# EAGLE schematic Main (EAGLE 7.4.0)

## Sheet 1 of 4
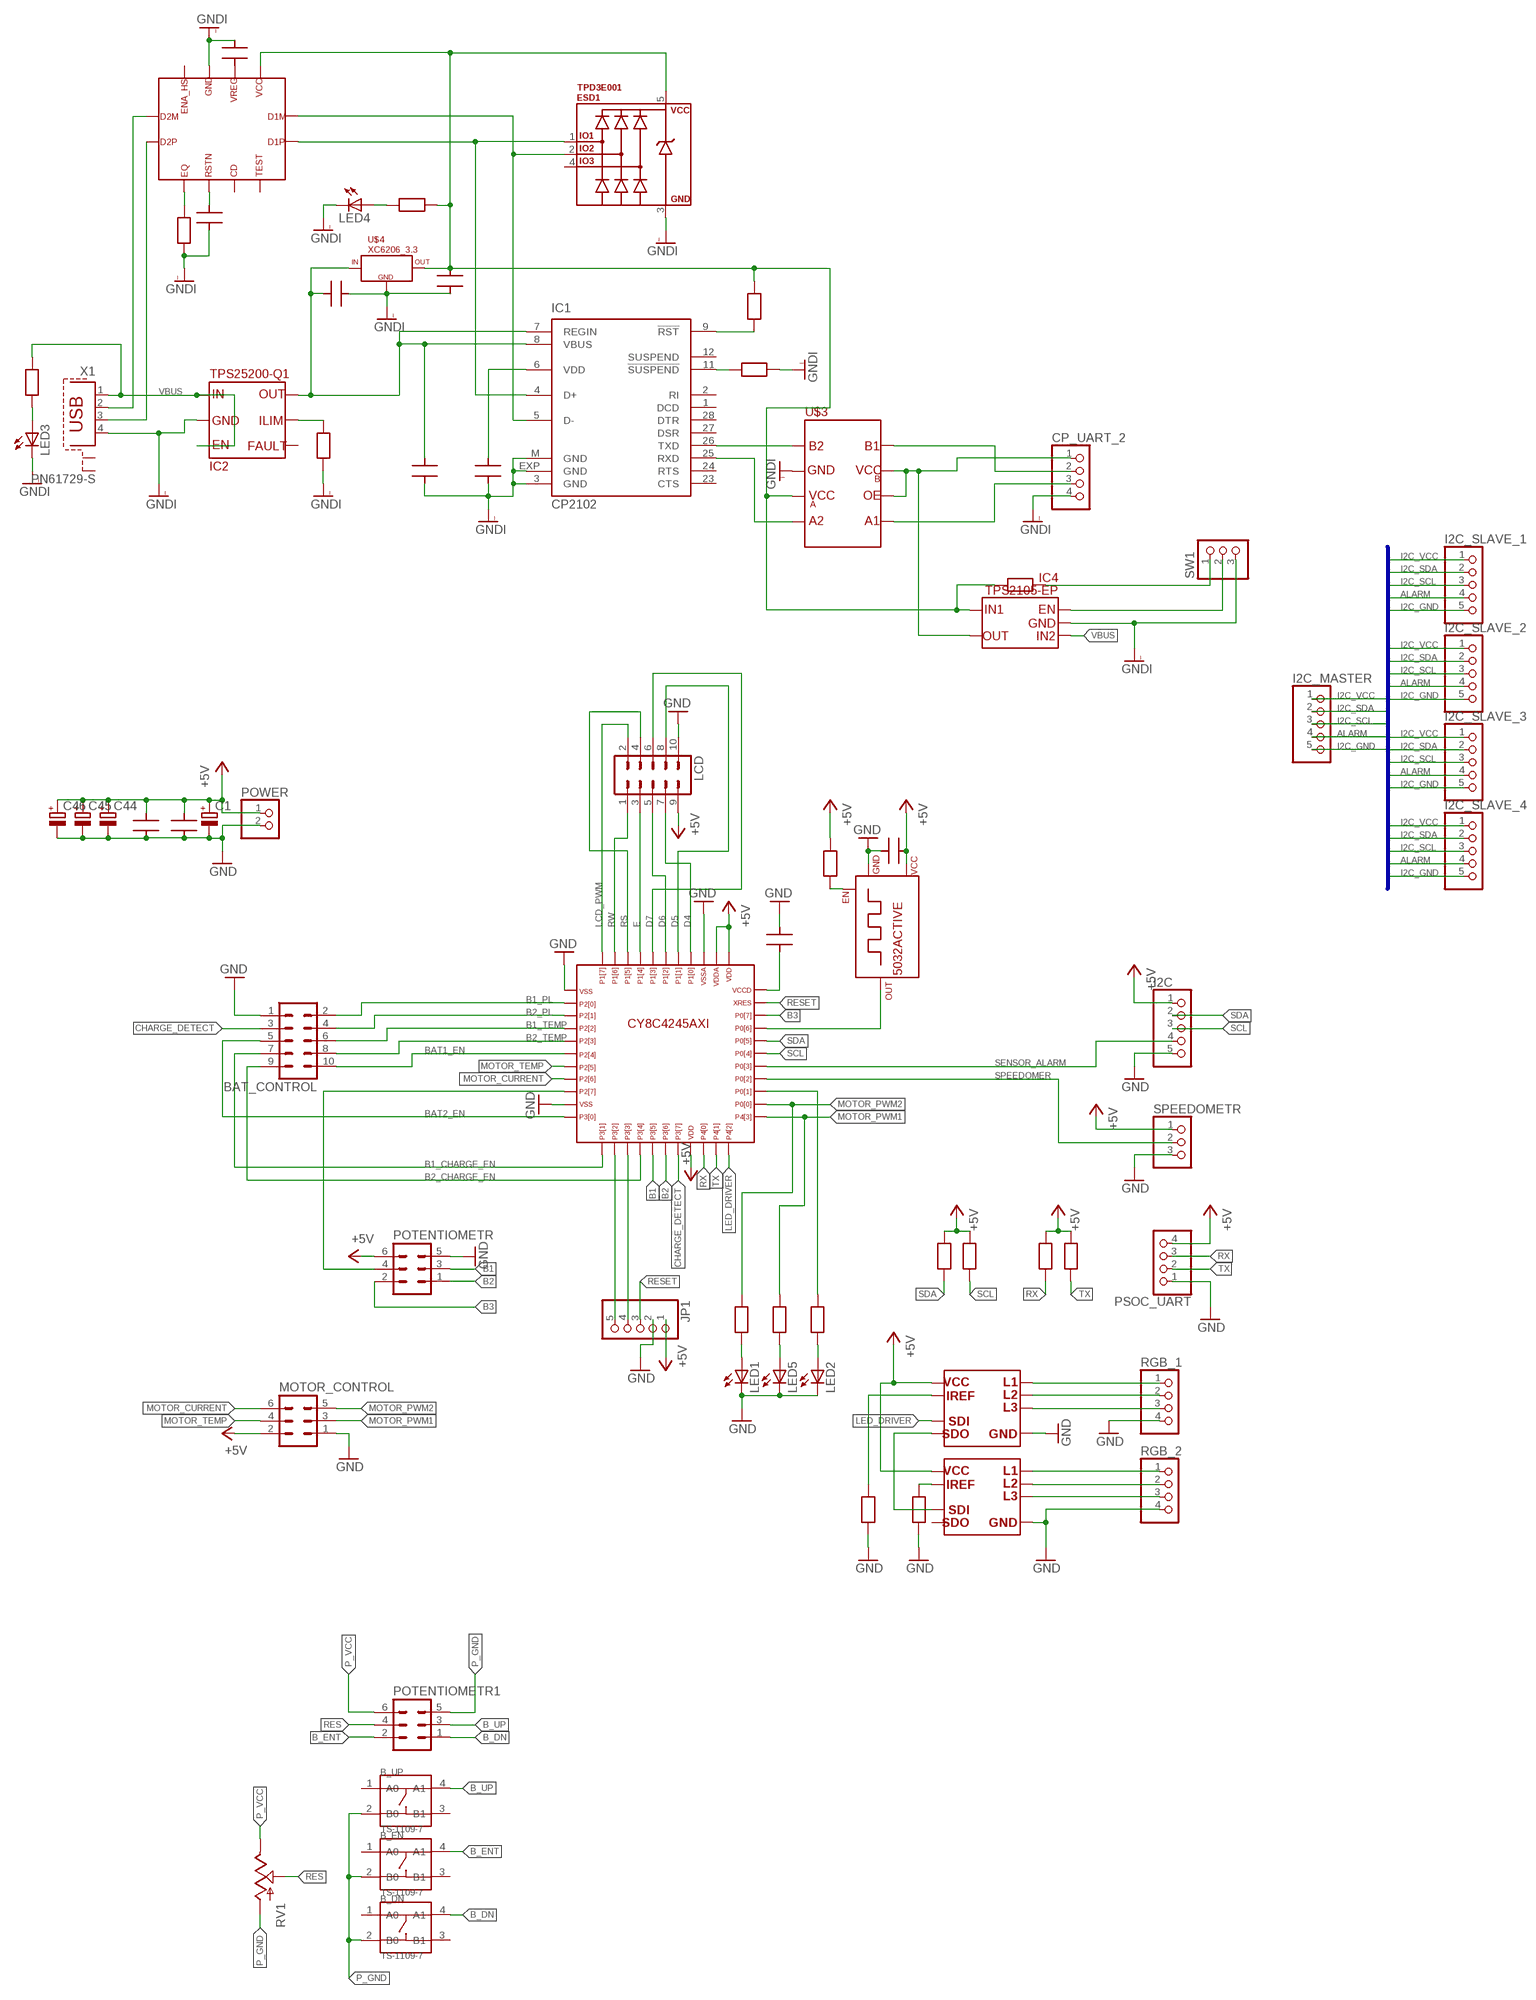
[diagram p0: schematic, sheet 1]

### Parts
B_DN  TS-1109-7  DIP-BUTTON-TOP-BLACK(4P-D6.2MM)  [SW4-6.2X6.2X5.0MM]
B_EN  TS-1109-7  DIP-BUTTON-TOP-BLACK(4P-D6.2MM)  [SW4-6.2X6.2X5.0MM]
B_UP  TS-1109-7  DIP-BUTTON-TOP-BLACK(4P-D6.2MM)  [SW4-6.2X6.2X5.0MM]
BAT_CONTROL  ML10  [ML10]
C1  CPOL-EU150CLZ-0810  [150CLZ-0810]
C2  CAP0603  [C0603]
C3  CAP0603  [C0603]
C4  CAP0603  [C0603]
C5  CAP0603  [C0603]
C6  CAP0603  [C0603]
C7  CAP0603  [C0603]
C8  CAP0603  [C0603]
C9  CAP0603  [C0603]
C10  CAP0603  [C0603]
C11  CAP0603  [C0603]
C44  CPOL-EU150CLZ-0810  [150CLZ-0810]
C45  CPOL-EUSMCD  [SMC_D]
C46  CPOL-EUSMCD  [SMC_D]
CP_UART_2  PINHD-1X4  [1X04]
ESD1  TPD3E001  [SOT23-5]
I2C  PINHD-1X5  [1X05]
I2C_MASTER  PINHD-1X5  [1X05]
I2C_SLAVE_1  PINHD-1X5  [1X05]
I2C_SLAVE_2  PINHD-1X5  [1X05]
I2C_SLAVE_3  PINHD-1X5  [1X05]
I2C_SLAVE_4  PINHD-1X5  [1X05]
IC1  CP2102  [MLP28]
IC2  TPS25200-Q1  [PWSON6]
IC4  TPS2105-EP  [SOT23-5]
JP1  PINHD-1X5  [1X05]
LCD  ML10  [ML10]
LED1  LEDCHIP-LED0603  [CHIP-LED0603]
LED2  LEDCHIP-LED0603  [CHIP-LED0603]
LED3  LEDCHIP-LED0805  [CHIP-LED0805]
LED4  LEDCHIP-LED0805  [CHIP-LED0805]
LED5  LEDCHIP-LED0603  [CHIP-LED0603]
LED_DR1  TLC5973  [SOIC8-1.27-5X4MM]
LED_DR2  TLC5973  [SOIC8-1.27-5X4MM]
MOTOR_CONTROL  ML6  [ML6]
POTENTIOMETR  ML6  [ML6]
POTENTIOMETR1  ML6  [ML6]
POWER  PINHD-1X2  [1X02]
PSOC_UART  PINHD-1X4  [1X04]
R1  RES0603  [R0603]
R2  RES0603  [R0603]
R3  RES0603  [R0603]
R4  RES0603  [R0603]
R5  RES0603  [R0603]
R6  RES0603  [R0603]
R7  RES0603  [R0603]
R8  RES0603  [R0603]
R9  RES0603  [R0603]
R10  RES0603  [R0603]
R11  RES0603  [R0603]
R12  RES0603  [R0603]
R13  RES0603  [R0603]
R14  RES0603  [R0603]
R15  RES0603  [R0603]
R16  RES0603  [R0603]
R41  RES0603  [R0603]
RGB_1  PINHD-1X4  [1X04]
RGB_2  PINHD-1X4  [1X04]
RV1  POT  [ALPS_POT]
SPEEDOMETR  PINHD-1X3  [1X03]
SW1  PINHD-1X3  [1X03]
U$1  CY8C4245  [TQFP44_CY_LOGO]
U$2  5032ACTIVE  [5030A]
U$3  TXS0102_SM8  [SM8]
U$4  XC6206_3.3  [SOT23]
USB1  TUSB211QRWBRQ1  [X2QFN]
X1  PN61729-S  [PN61729-S]

### Nets
+5V: C1.+ C2.2 C3.2 C5.2 C44.+ C45.+ C46.+ I2C.1 JP1.1 LCD.9 LED_DR1.8(OUT) LED_DR2.8(OUT) MOTOR_CONTROL.2 POTENTIOMETR.6 POWER.1 PSOC_UART.4 R1.2 R2.2 R3.2 R4.2 R7.2 SPEEDOMETR.1 U$1.19 U$1.34 U$1.35 U$2.4(+5V)
ALARM: I2C_MASTER.4 I2C_SLAVE_1.4 I2C_SLAVE_2.4 I2C_SLAVE_3.4 I2C_SLAVE_4.4
B1: POTENTIOMETR.3 U$1.16
B1_CHARGE_EN: BAT_CONTROL.7 U$1.12
B1_PL: BAT_CONTROL.2 U$1.2
B1_TEMP: BAT_CONTROL.6 U$1.4
B2: POTENTIOMETR.1 U$1.17
B2_CHARGE_EN: BAT_CONTROL.9 U$1.15
B2_PL: BAT_CONTROL.4 U$1.3
B2_TEMP: BAT_CONTROL.8 U$1.5
B3: POTENTIOMETR.2 U$1.31
B_DN: B_DN.4(A1) POTENTIOMETR1.1
B_ENT: B_EN.4(A1) POTENTIOMETR1.2
B_UP: B_UP.4(A1) POTENTIOMETR1.3
BAT1_EN: BAT_CONTROL.10 U$1.6
BAT2_EN: BAT_CONTROL.5 U$1.11
CHARGE_DETECT: BAT_CONTROL.3 U$1.18
D4: LCD.7 U$1.37
D5: LCD.8 U$1.38
D6: LCD.5 U$1.39
D7: LCD.6 U$1.40
E: LCD.3 U$1.41
GND: BAT_CONTROL.1 C1.- C2.1 C3.1 C4.1 C5.1 C44.- C45.- C46.- I2C.5 JP1.2 LCD.10 LED1.C LED2.C LED5.C LED_DR1.4(OUT) LED_DR2.4(OUT) MOTOR_CONTROL.1 POTENTIOMETR.5 POWER.2 PSOC_UART.1 R10.1 R11.1 RGB_1.4 RGB_2.4 SPEEDOMETR.3 U$1.1 U$1.10 U$1.36 U$2.2(GND)
GNDI: C6.1 C7.1 C8.1 C9.2 C10.1 C11.2 CP_UART_2.4 ESD1.3 IC1.3(GND) IC1.EXP(GND) IC1.M(GND) IC2.EPAD IC2.P$2 IC4.2 LED3.C LED4.C R9.1 R12.1 R15.1 SW1.3 U$3.GND U$4.1(GND) USB1.10 X1.4
I2C_GND: I2C_MASTER.5 I2C_SLAVE_1.5 I2C_SLAVE_2.5 I2C_SLAVE_3.5 I2C_SLAVE_4.5
I2C_SCL: I2C_MASTER.3 I2C_SLAVE_1.3 I2C_SLAVE_2.3 I2C_SLAVE_3.3 I2C_SLAVE_4.3
I2C_SDA: I2C_MASTER.2 I2C_SLAVE_1.2 I2C_SLAVE_2.2 I2C_SLAVE_3.2 I2C_SLAVE_4.2
I2C_VCC: I2C_MASTER.1 I2C_SLAVE_1.1 I2C_SLAVE_2.1 I2C_SLAVE_3.1 I2C_SLAVE_4.1
LCD_PWM: LCD.2 U$1.44
LED_DRIVER: LED_DR1.6(OUT) U$1.22
MOTOR_CURRENT: MOTOR_CONTROL.6 U$1.8
MOTOR_PWM1: MOTOR_CONTROL.3 R41.2 U$1.23
MOTOR_PWM2: MOTOR_CONTROL.5 R5.2 U$1.24
MOTOR_TEMP: MOTOR_CONTROL.4 U$1.7
N$1: U$1.30 U$2.3(OUT)
N$2: C4.2 U$1.33
N$3: JP1.5 U$1.13
N$4: JP1.4 U$1.14
N$7: IC2.P$1 IC2.P$3 R13.2 X1.1
N$8: R6.2 U$1.25
N$9: POTENTIOMETR.4 U$1.9
N$11: R7.1 U$2.1(EN)
N$12: C9.1 ESD1.5 IC4.5 R8.2 R14.2 R16.1 U$3.VCCA U$4.2(OUT) USB1.12
N$13: LED1.A R5.1
N$22: LED2.A R6.1
N$23: USB1.8 X1.2
N$24: IC1.9(!RST) R8.1
N$25: CP_UART_2.2 U$3.B1
N$26: IC1.11(!SUSPEND) R9.2
N$27: LED_DR1.5(OUT) LED_DR2.6(OUT)
N$28: ESD1.1 IC1.4(D+) USB1.2
N$29: LED_DR1.7(OUT) R11.2
N$30: LED_DR2.7(OUT) R10.2
N$31: LED_DR1.1(OUT) RGB_1.1
N$32: LED_DR1.2(OUT) RGB_1.2
N$33: LED_DR1.3(OUT) RGB_1.3
N$34: LED_DR2.1(OUT) RGB_2.1
N$35: LED_DR2.2(OUT) RGB_2.2
N$36: LED_DR2.3(OUT) RGB_2.3
N$38: ESD1.2 IC1.5(D-) USB1.1
N$39: IC2.P$5 R12.2
N$40: CP_UART_2.3 U$3.A1
N$41: R14.1 SW1.1
N$43: USB1.7 X1.3
N$44: LED3.A R13.1
N$45: LED4.A R16.2
N$47: C7.2 IC1.6(VDD)
N$48: IC1.26(TXD) U$3.B2
N$49: IC1.25(RXD) U$3.A2
N$50: IC4.1 SW1.2
N$51: CP_UART_2.1 IC4.4 U$3.OE U$3.VCCB
N$53: C10.2 USB1.5
N$54: R15.2 USB1.6
N$55: C11.1 USB1.11
N$93: LED5.A R41.1
P_GND: B_DN.2(B0) B_EN.2(B0) B_UP.2(B0) POTENTIOMETR1.5 RV1.P$3(A)
P_VCC: POTENTIOMETR1.6 RV1.P$1(E)
RES: POTENTIOMETR1.4 RV1.P$2(S)
RESET: JP1.3 U$1.32
RS: LCD.4 U$1.42
RW: LCD.1 U$1.43
RX: PSOC_UART.3 R3.1 U$1.20
SCL: I2C.3 R2.1 U$1.28
SDA: I2C.2 R1.1 U$1.29
SENSOR_ALARM: I2C.4 U$1.27
SPEEDOMER: SPEEDOMETR.2 U$1.26
TX: PSOC_UART.2 R4.1 U$1.21
VBUS: C6.2 C8.2 IC1.7(REGIN) IC1.8(VBUS) IC2.P$6 IC4.3 U$4.3(IN)
Unconnected: B_DN.1(A0) B_DN.3(B1) B_EN.1(A0) B_EN.3(B1) B_UP.1(A0) B_UP.3(B1) ESD1.4 IC1.1(DCD) IC1.2(RI) IC1.12(SUSPEND) IC1.23(CTS) IC1.24(RTS) IC1.27(DSR) IC1.28(DTR) IC2.P$4 LED_DR2.5(OUT) USB1.3 USB1.4 USB1.9 X1.S1 X1.S2

### Buses
I2C_VCC,I2C_GND,I2C_SCL,I2C_SDA,ALARM

## Sheet 2 of 4
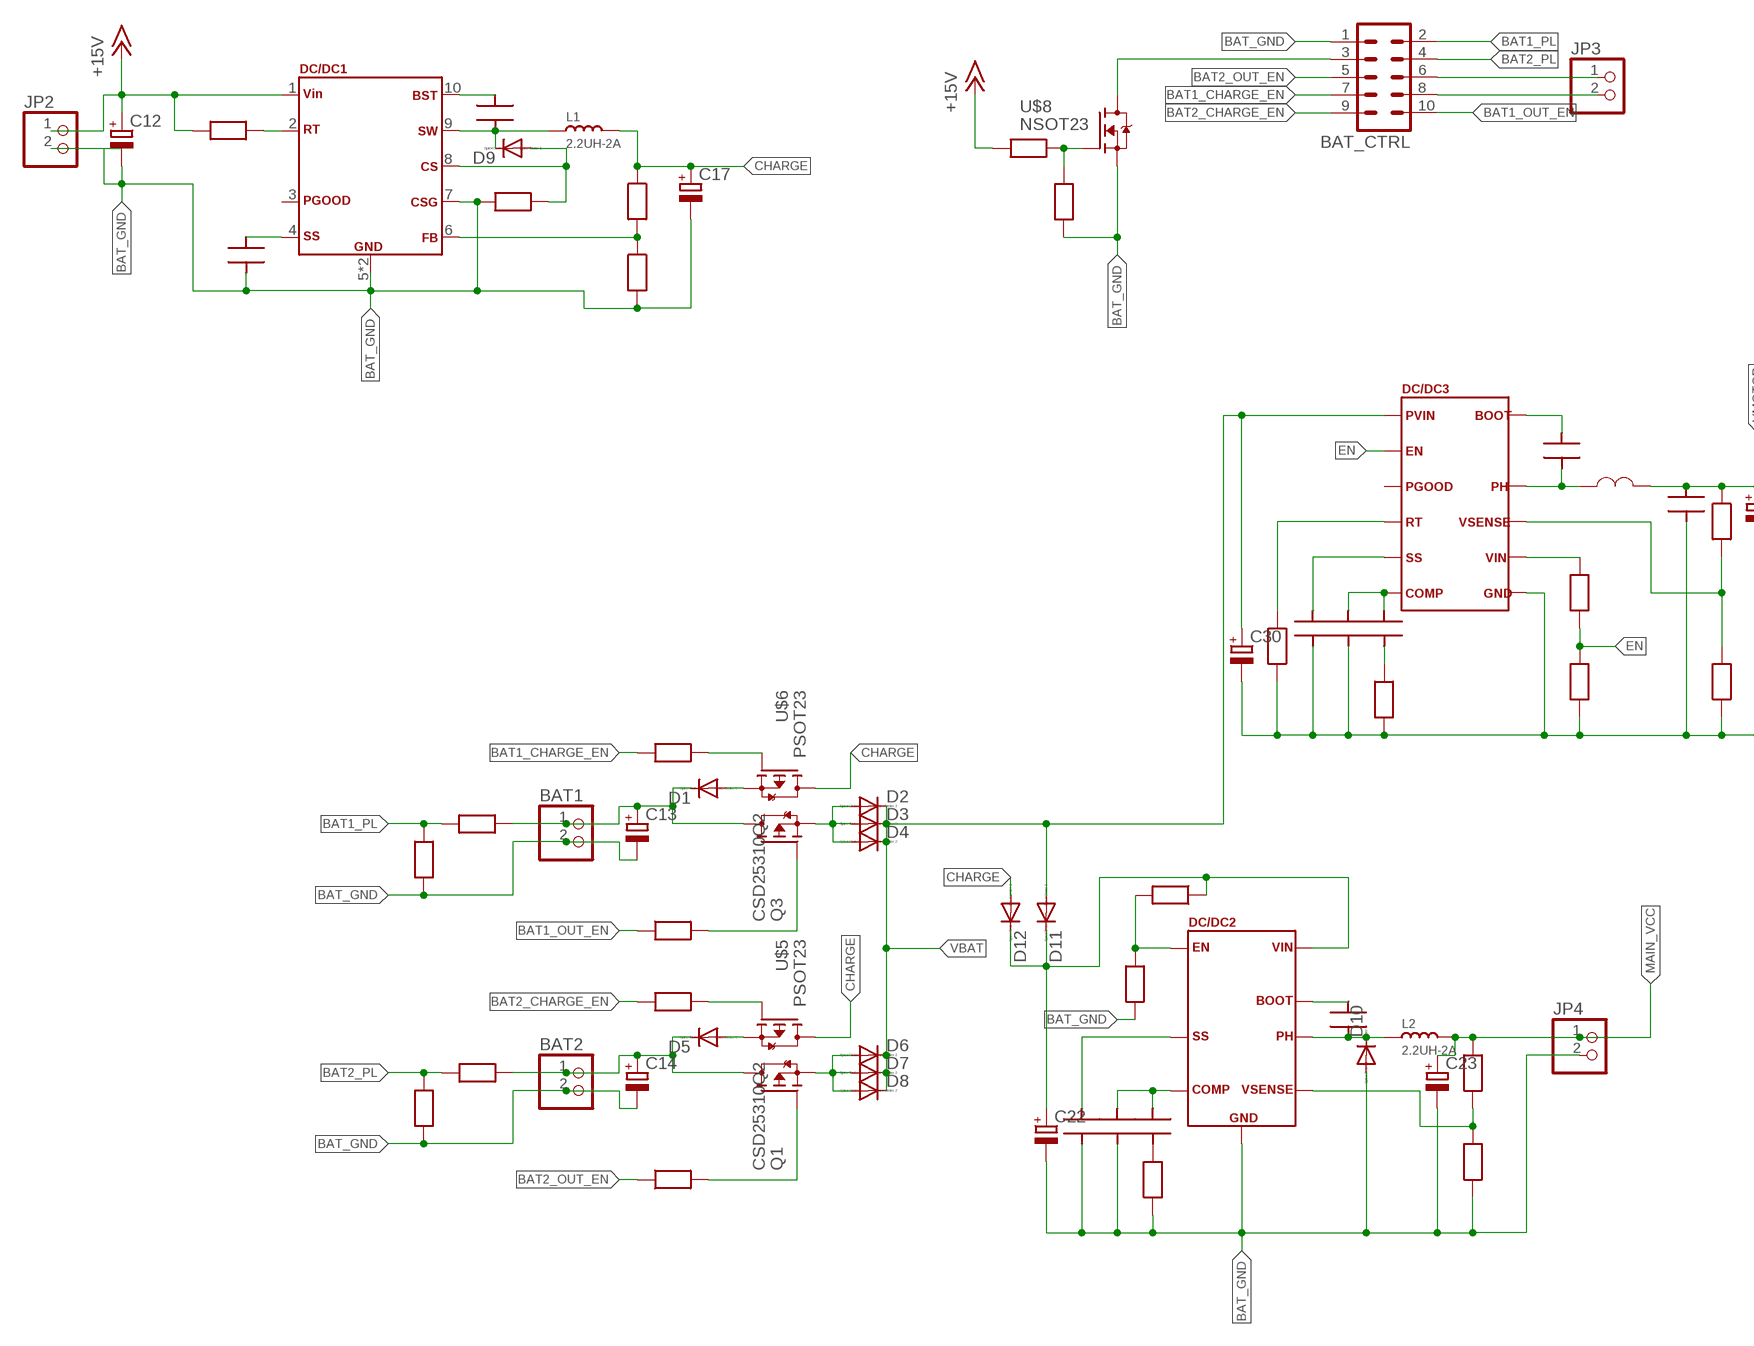
[diagram p1: schematic, sheet 2, part 1 of 2]
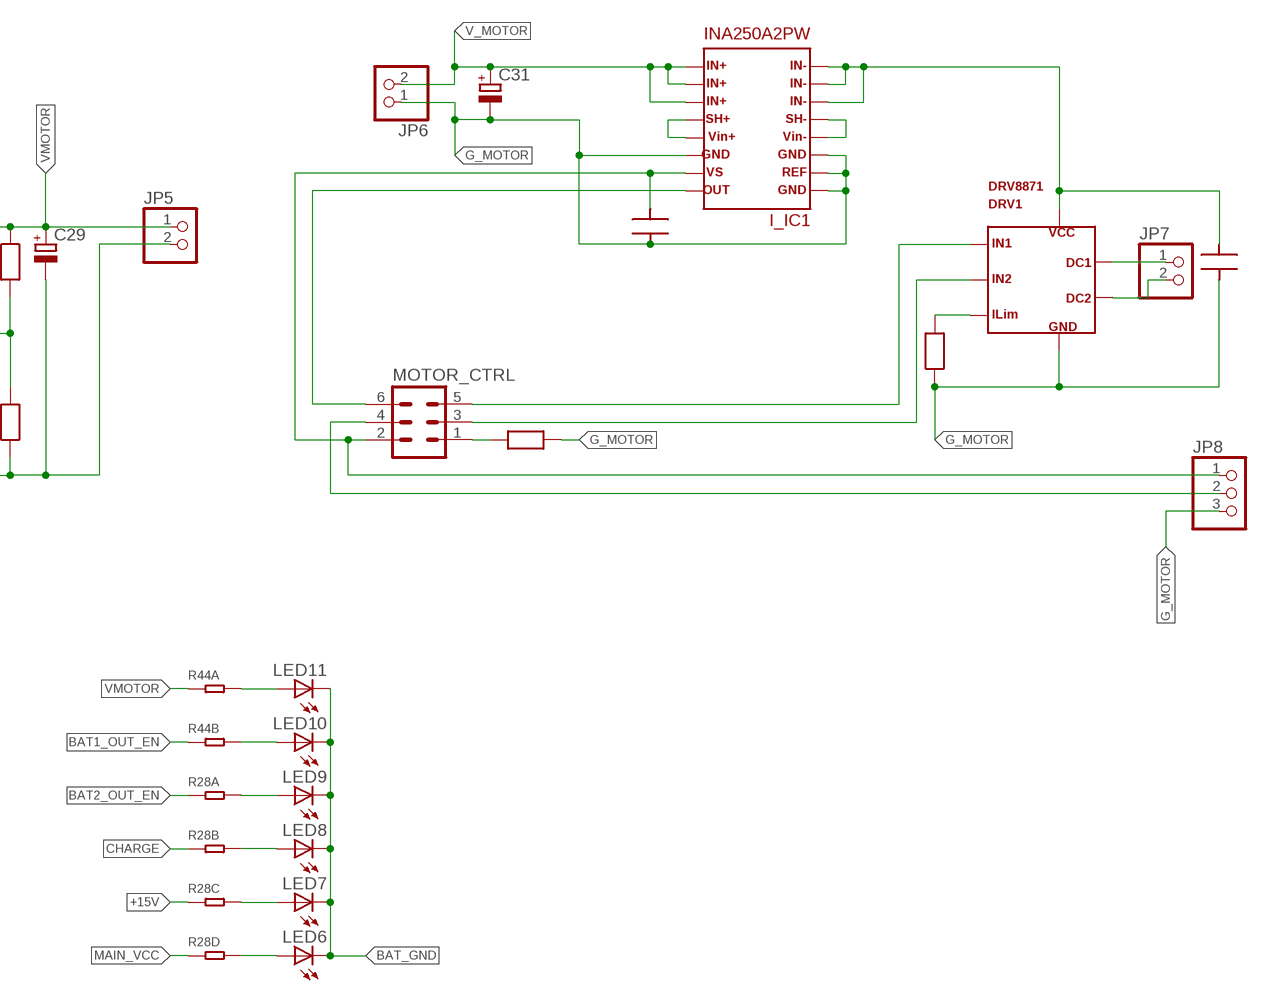
[diagram p2: schematic, sheet 2, part 2 of 2]

### Parts
BAT1  PINHD-1X2  [1X02]
BAT2  PINHD-1X2  [1X02]
BAT_CTRL  ML10  [ML10]
C12  CPOL-EU153CLV-0810  [153CLV-0810]
C13  CPOL-EU153CLV-0810  [153CLV-0810]
C14  CPOL-EU153CLV-0810  [153CLV-0810]
C15  CAP0603  [C0603]
C16  CAP0603  [C0603]
C17  CPOL-EU153CLV-0505  [153CLV-0505]
C18  CAP0603  [C0603]
C19  CAP0603  [C0603]
C20  CAP0603  [C0603]
C21  CAP0603  [C0603]
C22  CPOL-EU153CLV-0505  [153CLV-0505]
C23  CPOL-EU153CLV-0505  [153CLV-0505]
C24  CAP0603  [C0603]
C25  CAP0603  [C0603]
C26  CAP0603  [C0603]
C27  CAP0603  [C0603]
C28  CAP0603  [C0603]
C29  CPOL-EU153CLV-0505  [153CLV-0505]
C30  CPOL-EU153CLV-0505  [153CLV-0505]
C31  CPOL-EU153CLV-0505  [153CLV-0505]
C32  CAP0603  [C0603]
C33  CAP0603  [C0603]
D1  DIODE-DO-214AC  [DO-214AC]
D2  DIODE-DO-214AC  [DO-214AC]
D3  DIODE-DO-214AC  [DO-214AC]
D4  DIODE-DO-214AC  [DO-214AC]
D5  DIODE-DO-214AC  [DO-214AC]
D6  DIODE-DO-214AC  [DO-214AC]
D7  DIODE-DO-214AC  [DO-214AC]
D8  DIODE-DO-214AC  [DO-214AC]
D9  DIODE-MELF-MLL41  [MELF-MLL41]
D10  DIODE-DO-214AC  [DO-214AC]
D11  DIODE-DO-214AC  [DO-214AC]
D12  DIODE-DO-214AC  [DO-214AC]
DC/DC1  LM25011  [HVSSOP-10]
DC/DC2  TPS54232  [SOIC8-1.27-5X4MM]
DC/DC3  TPS54622  [VQFN-14_PWR]
DRV1  DRV8871  [HTSOP8]
I_IC1  INA250A2PW  [SSOP16]
JP2  PINHD-1X2  [1X02]
JP3  PINHD-1X2  [1X02]
JP4  PINHD-1X2  [1X02]
JP5  PINHD-1X2  [1X02]
JP6  PINHD-1X2  [1X02]
JP7  PINHD-1X2  [1X02]
JP8  PINHD-1X3  [1X03]
L1  2.2UH-2A  SMD-INDUCTOR-2.2UH-20%-2A(2P-4.8X4.6MM)  [INT2-SMD-4.8X4.6X1.0MM]
L2  2.2UH-2A  SMD-INDUCTOR-2.2UH-20%-2A(2P-4.8X4.6MM)  [INT2-SMD-4.8X4.6X1.0MM]
L$1  LDCP  [LDCP]
LED6  LEDCHIPLED_1206  [CHIPLED_1206]
LED7  LEDCHIPLED_1206  [CHIPLED_1206]
LED8  LEDCHIPLED_1206  [CHIPLED_1206]
LED9  LEDCHIPLED_1206  [CHIPLED_1206]
LED10  LEDCHIPLED_1206  [CHIPLED_1206]
LED11  LEDCHIPLED_1206  [CHIPLED_1206]
MOTOR_CTRL  ML6  [ML6]
Q1  CSD25310Q2  [SON_Q2]
Q3  CSD25310Q2  [SON_Q2]
R17  RES0603  [R0603]
R18  RES0603  [R0603]
R19  RES0603  [R0603]
R20  RES0603  [R0603]
R21  RES0603  [R0603]
R22  RES0603  [R0603]
R23  RES0603  [R0603]
R24  RES0603  [R0603]
R25  RES0603  [R0603]
R26  RES0603  [R0603]
R27  RES0603  [R0603]
R28  RES-ARRAY-1206  [RA1206-8]
R29  RES0603  [R0603]
R30  RES0603  [R0603]
R31  RES0603  [R0603]
R32  RES0603  [R0603]
R33  RES0603  [R0603]
R34  RES0603  [R0603]
R35  RES0603  [R0603]
R36  RES0603  [R0603]
R37  RES0603  [R0603]
R38  RES0603  [R0603]
R39  RES0603  [R0603]
R40  RES0603  [R0603]
R42  RES0603  [R0603]
R43  RES0603  [R0603]
R44  RES-ARRAY-1206  [RA1206-8]
R45  RES0603  [R0603]
R46  RES0603  [R0603]
U$5  PSOT23  [SOT23]
U$6  PSOT23  [SOT23]
U$8  NSOT23  [SOT23W]

### Nets
+15V: C12.+ DC/DC1.1 JP2.1 R25.2 R28.3 R42.1
BAT1_CHARGE_EN: BAT_CTRL.7 R24.1
BAT1_OUT_EN: BAT_CTRL.10 R23.1 R44.2
BAT1_PL: BAT_CTRL.2 R17.2 R18.2
BAT2_CHARGE_EN: BAT_CTRL.9 R22.1
BAT2_OUT_EN: BAT_CTRL.5 R21.1 R28.1
BAT2_PL: BAT_CTRL.4 R19.1 R20.1
BAT_GND: BAT1.2 BAT2.2 BAT_CTRL.1 C12.- C13.- C14.- C15.1 C17.- C18.1 C20.1 C22.- C23.- C24.1 C25.1 C28.1 C29.- C30.- D10.A DC/DC1.5 DC/DC1.7 DC/DC1.EPAD DC/DC2.7 DC/DC3.2 DC/DC3.3 DC/DC3.EPAD_BIG DC/DC3.EPAD_M1 DC/DC3.EPAD_M2 DC/DC3.EPAD_M3 DC/DC3.EPAD_M4 JP2.2 JP4.2 JP5.2 LED6.C LED7.C LED8.C LED9.C LED10.C LED11.C R17.1 R19.2 R26.2 R29.1 R30.1 R32.1 R33.1 R35.1 R36.1 R38.1 R40.1 R43.1 U$8.S
CHARGE: C17.+ D12.A L1.2 R27.1 R28.2 U$5.S U$6.S
EN: DC/DC3.10 R37.2 R38.2
G_MOTOR: C31.- C32.2 C33.2 DRV1.1 DRV1.7 DRV1.EPAD_B DRV1.EPAD_T DRV1.EPAD_VIA1 DRV1.EPAD_VIA2 DRV1.EPAD_VIA3 DRV1.EPAD_VIA4 DRV1.EPAD_VIA5 DRV1.EPAD_VIA6 I_IC1.P$6 I_IC1.P$7 I_IC1.P$8 I_IC1.P$11 JP6.1 JP8.3 R45.1 R46.1
MAIN_VCC: C23.+ JP4.1 L2.2 R28.4 R34.2
N$5: BAT_CTRL.6 JP3.1
N$6: BAT_CTRL.8 JP3.2
N$10: BAT_CTRL.3 U$8.D
N$46: D2.A D3.A D4.A Q3.4(D) Q3.D
N$56: D1.A U$6.D
N$57: BAT1.1 C13.+ D1.C Q3.1(S) Q3.2(S) Q3.5(S) Q3.6(S) Q3.S R18.1
N$58: Q3.3(G) R23.2
N$59: BAT2.1 C14.+ D5.C Q1.1(S) Q1.2(S) Q1.5(S) Q1.6(S) Q1.S R20.2
N$60: R24.2 U$6.G
N$61: R42.2 R43.2 U$8.G
N$62: D6.A D7.A D8.A Q1.4(D) Q1.D
N$63: D5.A U$5.D
N$64: Q1.3(G) R21.2
N$65: R22.2 U$5.G
N$66: LED11.A R44.8
N$67: DC/DC1.2 R25.1
N$68: C15.2 DC/DC1.4
N$69: DC/DC1.6 R26.1 R27.2
N$70: LED10.A R44.7
N$71: D9.A DC/DC1.8 R29.2
N$72: C16.1 D9.C DC/DC1.9 L1.1
N$73: C16.2 DC/DC1.10
N$74: DC/DC2.3 R30.2 R31.2
N$75: LED9.A R28.8
N$76: C19.1 R32.2
N$77: C18.2 C19.2 DC/DC2.6
N$78: C24.2 DC/DC3.9
N$79: C20.2 DC/DC2.4
N$80: DC/DC3.1 R35.2
N$81: C21.2 DC/DC2.1
N$82: C21.1 D10.C DC/DC2.8 L2.1
N$83: DC/DC2.5 R33.2 R34.1
N$84: LED8.A R28.7
N$85: C25.2 C26.2 DC/DC3.8
N$86: C26.1 R36.2
N$87: DC/DC3.6 R37.1
N$88: C27.2 DC/DC3.13
N$89: C27.1 DC/DC3.11 DC/DC3.12 L$1.P$1
N$90: DC/DC3.7 R39.2 R40.2
N$91: LED7.A R28.6
N$92: LED6.A R28.5
N$94: I_IC1.P$12 I_IC1.P$13
N$95: I_IC1.P$4 I_IC1.P$5
N$96: MOTOR_CTRL.1 R46.2
N$97: C33.1 DRV1.5 I_IC1.P$1 I_IC1.P$2 I_IC1.P$3
N$98: DRV1.3 MOTOR_CTRL.5
N$99: DRV1.2 MOTOR_CTRL.3
N$100: DRV1.4 R45.2
N$101: DRV1.6 JP7.1
N$102: DRV1.8 JP7.2
N$103: C32.1 I_IC1.P$10 JP8.1 MOTOR_CTRL.2
N$104: I_IC1.P$9 MOTOR_CTRL.6
N$105: JP8.2 MOTOR_CTRL.4
N$122: C22.+ D11.C D12.C DC/DC2.2 R31.1
V_MOTOR: C31.+ I_IC1.P$14 I_IC1.P$15 I_IC1.P$16 JP6.2
VBAT: C30.+ D2.C D3.C D4.C D6.C D7.C D8.C D11.A DC/DC3.4 DC/DC3.5
VMOTOR: C28.2 C29.+ JP5.1 L$1.P$2 R39.1 R44.1
Unconnected: DC/DC1.3 DC/DC3.14 R44.3 R44.4 R44.5 R44.6

## Sheet 3 of 4
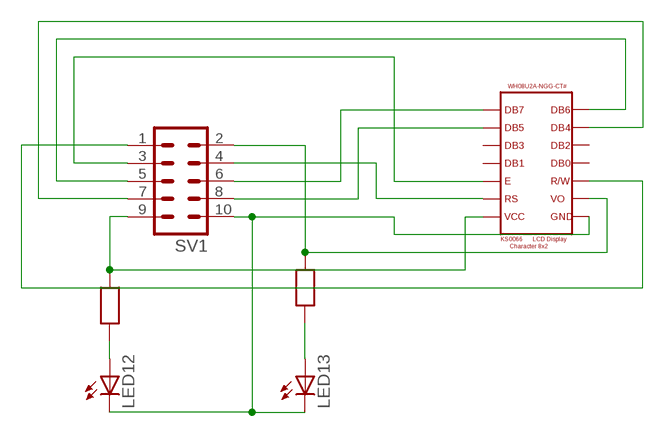
[diagram p3: schematic, sheet 3]

### Parts
LED12  LEDCHIPLED_1206  [CHIPLED_1206]
LED13  LEDCHIPLED_1206  [CHIPLED_1206]
R47  RES0603  [R0603]
R48  RES0603  [R0603]
SV1  ML10  [ML10]
U$7  8X2_KS066  [7X2]

### Nets
N$14: R47.2 SV1.9 U$7.2
N$15: LED12.C LED13.C SV1.10 U$7.1
N$16: SV1.7 U$7.11
N$17: SV1.5 U$7.13
N$18: SV1.3 U$7.6
N$19: SV1.1 U$7.5
N$20: SV1.8 U$7.12
N$21: SV1.6 U$7.14
N$106: SV1.4 U$7.4
N$107: R48.2 SV1.2 U$7.3
N$108: LED12.A R47.1
N$109: LED13.A R48.1
Unconnected: U$7.7 U$7.8 U$7.9 U$7.10

## Sheet 4 of 4
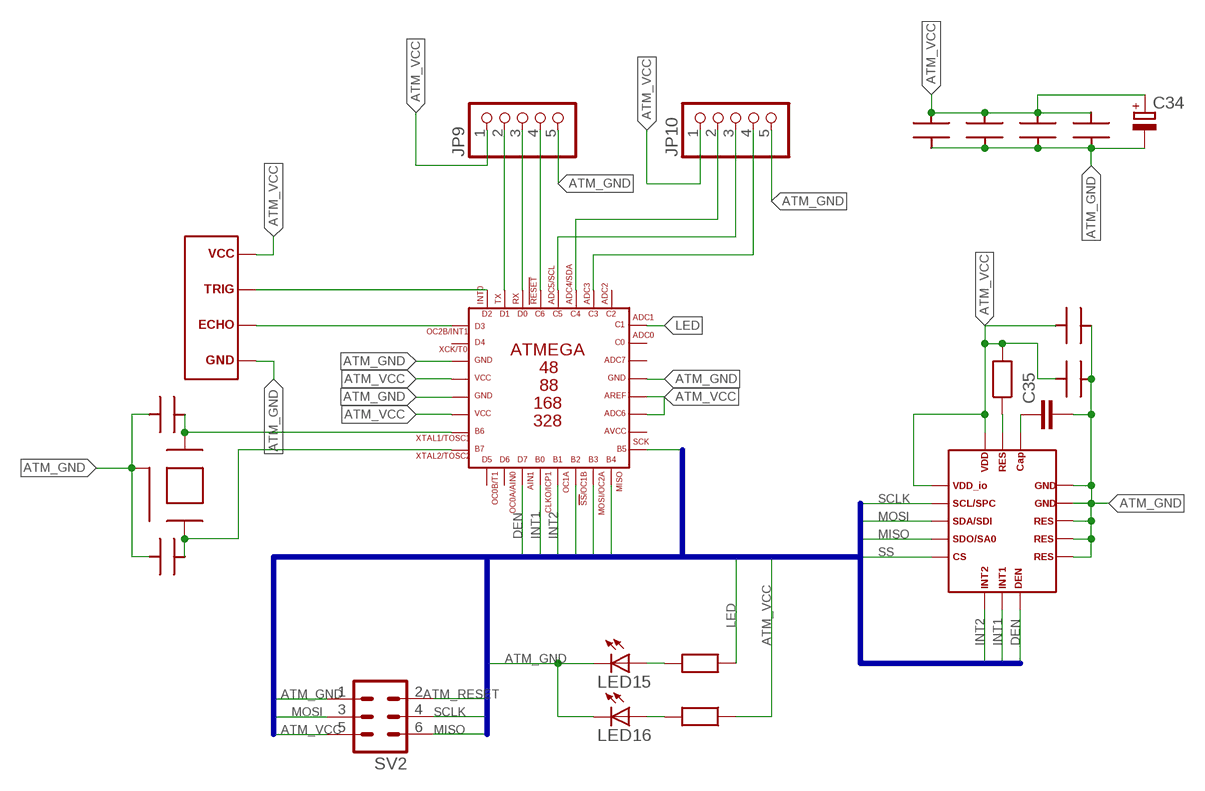
[diagram p4: schematic, sheet 4]

### Parts
C34  CPOL-EU153CLV-0505  [153CLV-0505]
C35  C-EUC1206  [C1206]
C36  CAP0603  [C0603]
C37  CAP0603  [C0603]
C38  CAP0603  [C0603]
C39  CAP0603  [C0603]
C40  CAP0603  [C0603]
C41  CAP0603  [C0603]
C42  CAP0603  [C0603]
C43  CAP0603  [C0603]
GYRO1  L3GD20H  [LGA_3X3_16]
JP9  PINHD-1X5  [1X05]
JP10  PINHD-1X5  [1X05]
LED15  LEDCHIPLED_0603  [CHIPLED_0603]
LED16  LEDCHIPLED_0603  [CHIPLED_0603]
LIDAR1  HC-SR04  [HC-SR04]
R49  RES0603  [R0603]
R50  RES0603  [R0603]
R51  RES0603  [R0603]
SV2  ML6  [ML6]
U$9  ATMEGAN8  [TQFP32-08]
U$10  3225PASSIVE  [3225]

### Nets
ATM_GND: C34.- C35.2 C36.2 C37.2 C38.1 C39.1 C40.1 C41.1 C42.1 C43.1 GYRO1.9 GYRO1.10 GYRO1.11 GYRO1.12 GYRO1.13 JP9.5 JP10.5 LED15.C LED16.C LIDAR1.4 SV2.1 U$9.GND U$9.GND1 U$9.GND2 U$10.2 U$10.4
ATM_RESET: JP9.4 SV2.2 U$9.C6
ATM_VCC: C34.+ C36.1 C37.1 C38.2 C39.2 C40.2 C41.2 GYRO1.1 GYRO1.16 JP9.1 JP10.1 LIDAR1.1 R49.2 R51.1 SV2.5 U$9.ADC6 U$9.AREF U$9.VCC U$9.VCC1
DEN: GYRO1.8 U$9.D7
INT1: GYRO1.7 U$9.B0
INT2: GYRO1.6 U$9.B1
LED: R50.1 U$9.C1
MISO: GYRO1.4 SV2.6 U$9.B4
MOSI: GYRO1.3 SV2.3 U$9.B3
N$110: JP9.2 U$9.D1
N$111: JP9.3 U$9.D0
N$112: LED15.A R50.2
N$113: JP10.2 U$9.C4
N$114: JP10.3 U$9.C5
N$115: JP10.4 U$9.C3
N$116: LIDAR1.3 U$9.D3
N$117: LIDAR1.2 U$9.D2
N$118: C43.2 U$9.B6 U$10.1
N$119: C42.2 U$9.B7 U$10.3
N$121: LED16.A R51.2
N$123: GYRO1.15 R49.1
N$124: C35.1 GYRO1.14
SCLK: GYRO1.2 SV2.4 U$9.B5
SS: GYRO1.5 U$9.B2
Unconnected: U$9.ADC7 U$9.AVCC U$9.C0 U$9.C2 U$9.D4 U$9.D5 U$9.D6

### Buses
ATM_VCC,ATM_GND,ATM_RESET,MOSI,MISO,SCLK,SS,INT1,INT2,DEN,GYRO_RESET,LED

## Library data of the parts
B_DN B_EN B_UP = Seeed-OPL-Switch:DIP-BUTTON-TOP-BLACK(4P-D6.2MM): 311020032; MPN: TS-1109-7
BAT1 BAT2 JP2-JP7 POWER = pinhead:PINHD-1X2: PIN HEADER
BAT_CONTROL BAT_CTRL LCD SV1 = con-ml:ML10: HARTING; OC_FARNELL: unknown; OC_NEWARK: unknown
C1 C12-C14 C17 C22 C23 C29-C31 C34 C44-C46 = rcl:CPOL-EU: POLARIZED CAPACITOR, European symbol
C2-C11 C15 C16 C18-C21 C24-C28 C32 C33 C36-C43 = My_RLC:CAP0603: Ceramic Capasitor SMD 0603
C35 = rcl:C-EU: CAPACITOR, European symbol
CP_UART_2 PSOC_UART RGB_1 RGB_2 = pinhead:PINHD-1X4: PIN HEADER
D1-D12 = diode:DIODE-: DIODE
DC/DC1 = My_TI:LM25011: LM25011 Constant On-Time Switching Regulator With Adjustable Current Limit. Input Operating Voltage Range: 6 V to 42 V. Integrated 2-A N-Channel Buck Switch. Adjustable Current Limit Allows for Smaller inductor. Adjustable Output Voltage from 2.51 V. Datasheet <http://www.ti.com/lit/ds/symlink/lm25011.pdf>
DC/DC2 = My_TI:TPS54232: TPS54232 2-A, 28-V, 1-MHz, Step-Down DC-DC Converter With Eco-Mode™. 3.5-V to 28-V Input Voltage Range. Adjustable Output Voltage Down to 0.8 V. Fixed 1-MHz Switching Frequency. Datasheet <http://www.ti.com/lit/ds/symlink/tps54232.pdf>
DC/DC3 = My_TI:TPS54622: TPS54622 4.5-V to 17-V Input, 6-A Synchronous Step-Down SWIFT™ Converter With Hiccup Protection. • 200-kHz to 1.6-MHz Switching Frequency. • –40°C to 150°C Operating Junction Temperature Range. • Adjustable Slow Start and Power Sequencing. Datasheet <http://www.ti.com/lit/ds/symlink/tps54622.pdf>
DRV1 = My_TI:DRV8871: DRV8871 3.6-A Brushed DC Motor Driver With Internal Current Sense (PWM Control). • Wide 6.5-V to 45-V Operating Voltage • 565-mΩ Typical RDS(on) (HS + LS) • 3.6-A Peak Current Drive • PWM Control Interface • Current Regulation Without a Sense Resistor Datasheet <http://www.ti.com/lit/ds/symlink/drv8871.pdf>
ESD1 = My_TI:TPD3E001: TPD3E001 Low-Capacitance 3-Channel ESD-Protection for High-Speed Data Interfaces. IEC61000-4-2 Level-4 ESD Protection: – ±8-kV IEC 61000-4-2 Contact Discharge. – ±15-kV IEC 61000-4-2 Air-Gap Discharge. 5.5-A Peak Pulse Current (8/20-µs Pulse). 0.9-V to 5.5-V Supply-Voltage Range. Datasheet <http://www.ti.com/lit/ds/symlink/tpd3e001.pdf>
GYRO1 = Sensors:L3GD20H: MEMS motion sensor: three-axis digital output gyroscope. Wide supply voltage, 2.2 V to 3.6 V. Low voltage compatible IOs, 1.8 V. Datasheet <http://www.st.com/st-web-ui/static/active/en/resource/technical/document/datasheet/DM00060659.pdf>
I2C I2C_MASTER I2C_SLAVE_1-I2C_SLAVE_4 JP1 JP9 JP10 = pinhead:PINHD-1X5: PIN HEADER
I_IC1 = My_TI:INA250A2PW: 36-V, Low- or High-Side, Bidirectional, Zero-Drift Current-Shunt Monitor with Precision Integrated Shunt Resistor
IC1 = silabs:CP210*: Single-Chip USB to UART Bridge Source: www.silabs.com .. CP2101.pdf / cp2102.pdf; MF: FARNELL; MPN: CP2102-GM; OC_FARNELL: 9282130; OC_NEWARK: 30K5635
IC2 = My_TI:TPS25200-Q1: TPS25200-Q1 5-V eFuse With Precision Adjustable Current Limit and Overvoltage Clamp. Datasheet <http://www.ti.com/lit/ds/symlink/tps25200-q1.pdf>
IC4 = My_TI:TPS2105-EP: TPS2105-EP Dual-Input, Single-Output MOSFET Switch With No Reverse Current Flow. • 2.7-V to 5.5-V Operating Range. • IN1: 250-mΩ, 500-mA N-Channel; 18-µA Supply Curren. • IN2: 1.3-mΩ, 100-mA P-Channel; 0.75-µA Supply Curren. • Active-high enable for IN1-OUT switch. Dattasheet <http://www.ti.com/lit/ds/symlink/tps2105-ep.pdf>
JP8 SPEEDOMETR SW1 = pinhead:PINHD-1X3: PIN HEADER
L1 L2 = Seeed-OPL-Inductor:SMD-INDUCTOR-2.2UH-20%-2A(2P-4.8X4.6MM): 303010022; MPN: VLF5010ST-2R2M2R0
L$1 = My_RLC:LDCP
LED1-LED13 LED15 LED16 = led:LED: LED OSRAM: - CHIPLED LG R971, LG N971, LY N971, LG Q971, LY Q971, LO R971, LY R971 LH N974, LH R974 LS Q976, LO Q976, LY Q976 LO Q996 - Hyper CHIPLED LW Q18S LB Q993, LB Q99A, LB R99A - SideLED LS A670, LO A670, LY A670, LG A670, LP A670 LB A673, LV A673, LT A673, LW A673 LH A674 LY A675 LS A676, LA A676, LO A676, LY A676, LW A676 LS A679, LY A679, LG A679 - Hyper Micro SIDELED® LS Y876, LA Y876, LO Y876, LY Y876 LT Y87S - SmartLED LW L88C, LW L88S LB L89C, LB L89S, LG L890 LS L89K, LO L89K, LY L89K LS L896, LA L896, LO L896, LY L896 - TOPLED LS T670, LO T670, LY T670, LG T670, LP T670 LSG T670, LSP T670, LSY T670, LOP T670, LYG T670 LG T671, LOG T671, LSG T671 LB T673, LV T673, LT T673, LW T673 LH T674 LS T676, LA T676, LO T676, LY T676, LB T676, LH T676, LSB T676, LW T676 LB T67C, LV T67C, LT T67C, LS T67K, LO T67K, LY T67K, LW E67C LS E67B, LA E67B, LO E67B, LY E67B, LB E67C, LV E67C, LT E67C LW T67C LS T679, LY T679, LG T679 LS T770, LO T770, LY T770, LG T770, LP T770 LB T773, LV T773, LT T773, LW T773 LH T774 LS E675, LA E675, LY E675, LS T675 LS T776, LA T776, LO T776, LY T776, LB T776 LHGB T686 LT T68C, LB T68C - Hyper Mini TOPLED® LB M676 - Mini TOPLED Santana® LG M470 LS M47K, LO M47K, LY M47K Source: http://www.osram.convergy.de LUXEON: - LUMILED® LXK2-PW12-R00, LXK2-PW12-S00, LXK2-PW14-U00, LXK2-PW14-V00 LXK2-PM12-R00, LXK2-PM12-S00, LXK2-PM14-U00 LXK2-PE12-Q00, LXK2-PE12-R00, LXK2-PE12-S00, LXK2-PE14-T00, LXK2-PE14-U00 LXK2-PB12-K00, LXK2-PB12-L00, LXK2-PB12-M00, LXK2-PB14-N00, LXK2-PB14-P00, LXK2-PB14-Q00 LXK2-PR12-L00, LXK2-PR12-M00, LXK2-PR14-Q00, LXK2-PR14-R00 LXK2-PD12-Q00, LXK2-PD12-R00, LXK2-PD12-S00 LXK2-PH12-R00, LXK2-PH12-S00 LXK2-PL12-P00, LXK2-PL12-Q00, LXK2-PL12-R00 Source: www.luxeon.com KINGBRIGHT: KA-3528ASYC Source: www.kingbright.com
LED_DR1 LED_DR2 = My_TI:TLC5973: 3-Channel, 12-Bit, PWM Constant-Current LED Driver with Single-Wire Interface (EasySet™)
LIDAR1 = Sensors:HC-SR04: HC - SR04 Ultrasonic Ranging Module. Datasheet <http://www.micropik.com/PDF/HCSR04.pdf>
MOTOR_CONTROL MOTOR_CTRL POTENTIOMETR POTENTIOMETR1 SV2 = con-ml:ML6: HARTING; OC_FARNELL: unknown; OC_NEWARK: unknown
Q1 Q3 = Mosfet_Logic:CSD25310Q2: CSD25310Q2 20 V P-Channel NexFET™ Power MOSFETs. Continuous Drain Current –9.6 A. Pulsed Drain Current 48 A. Datasheet <http://www.ti.com/lit/ds/symlink/csd25310q2.pdf>
R1-R27 R29-R43 R45-R51 = My_RLC:RES0603: Resistor SMD 0603
R28 R44 = Seeed-OPL-Resistor:RES-ARRAY: Resistor Array
RV1 = SparkFun-Electromechanical:POT; PROD_ID: RES-09177
U$1 = PsoC:CY8C4245
U$2 = Oscillatrs:5032ACTIVE
U$3 = Interface:TXS0102_SM8
U$4 = 74xx:XC6206_3.3
U$5 U$6 = Mosfet_Logic:PSOT23
U$7 = Displays:8X2_KS066
U$8 = Mosfet_Logic:NSOT23
U$9 = My Atmel:ATMEGAN8
U$10 = Oscillatrs:3225PASSIVE
USB1 = My_TI:TUSB211QRWBRQ1: TUSB211 USB 2.0 High Speed Signal Conditioner Compatible with USB 2.0, OTG 2.0 and BC 1.2 Active Power Consumption of 55 mW (Typical) with 3.3-V Single Supply Datasheet <http://www.ti.com/lit/ds/symlink/tusb211-q1.pdf>
X1 = con-berg:PN61729-S: BERG USB connector; OC_FARNELL: unknown; OC_NEWARK: unknown